# Altium schematic sheet SAMW25_Xplained_Pro_Connectors.SchDoc: Extension connectors
size A3; Organization: ATMEL Norway; Address1: Vestre Rosten 79; Address2: N-7075 TILLER; Address3: NORWAY; DocumentNumber: A09-2449; Revision: 1; SheetNumber: 4; SheetTotal: 5; PageSetup: Record=PageOptions|CenterHorizontal=True|CenterVertical=True|PrintScale=1.01|XCorrection=1.00|YCorrection=1.00|PrintKind=1|BorderSize=5000000|LeftOffset=0|BottomOffset=0|Orientation=2|PaperLength=1000|PaperWidth=1000|Scale=100|PaperSource=7|PrintQuality=-4|MediaType=1|DitherType=10|PaperKind=A3 (297 x 420 mm)|PrintScaleMode=1
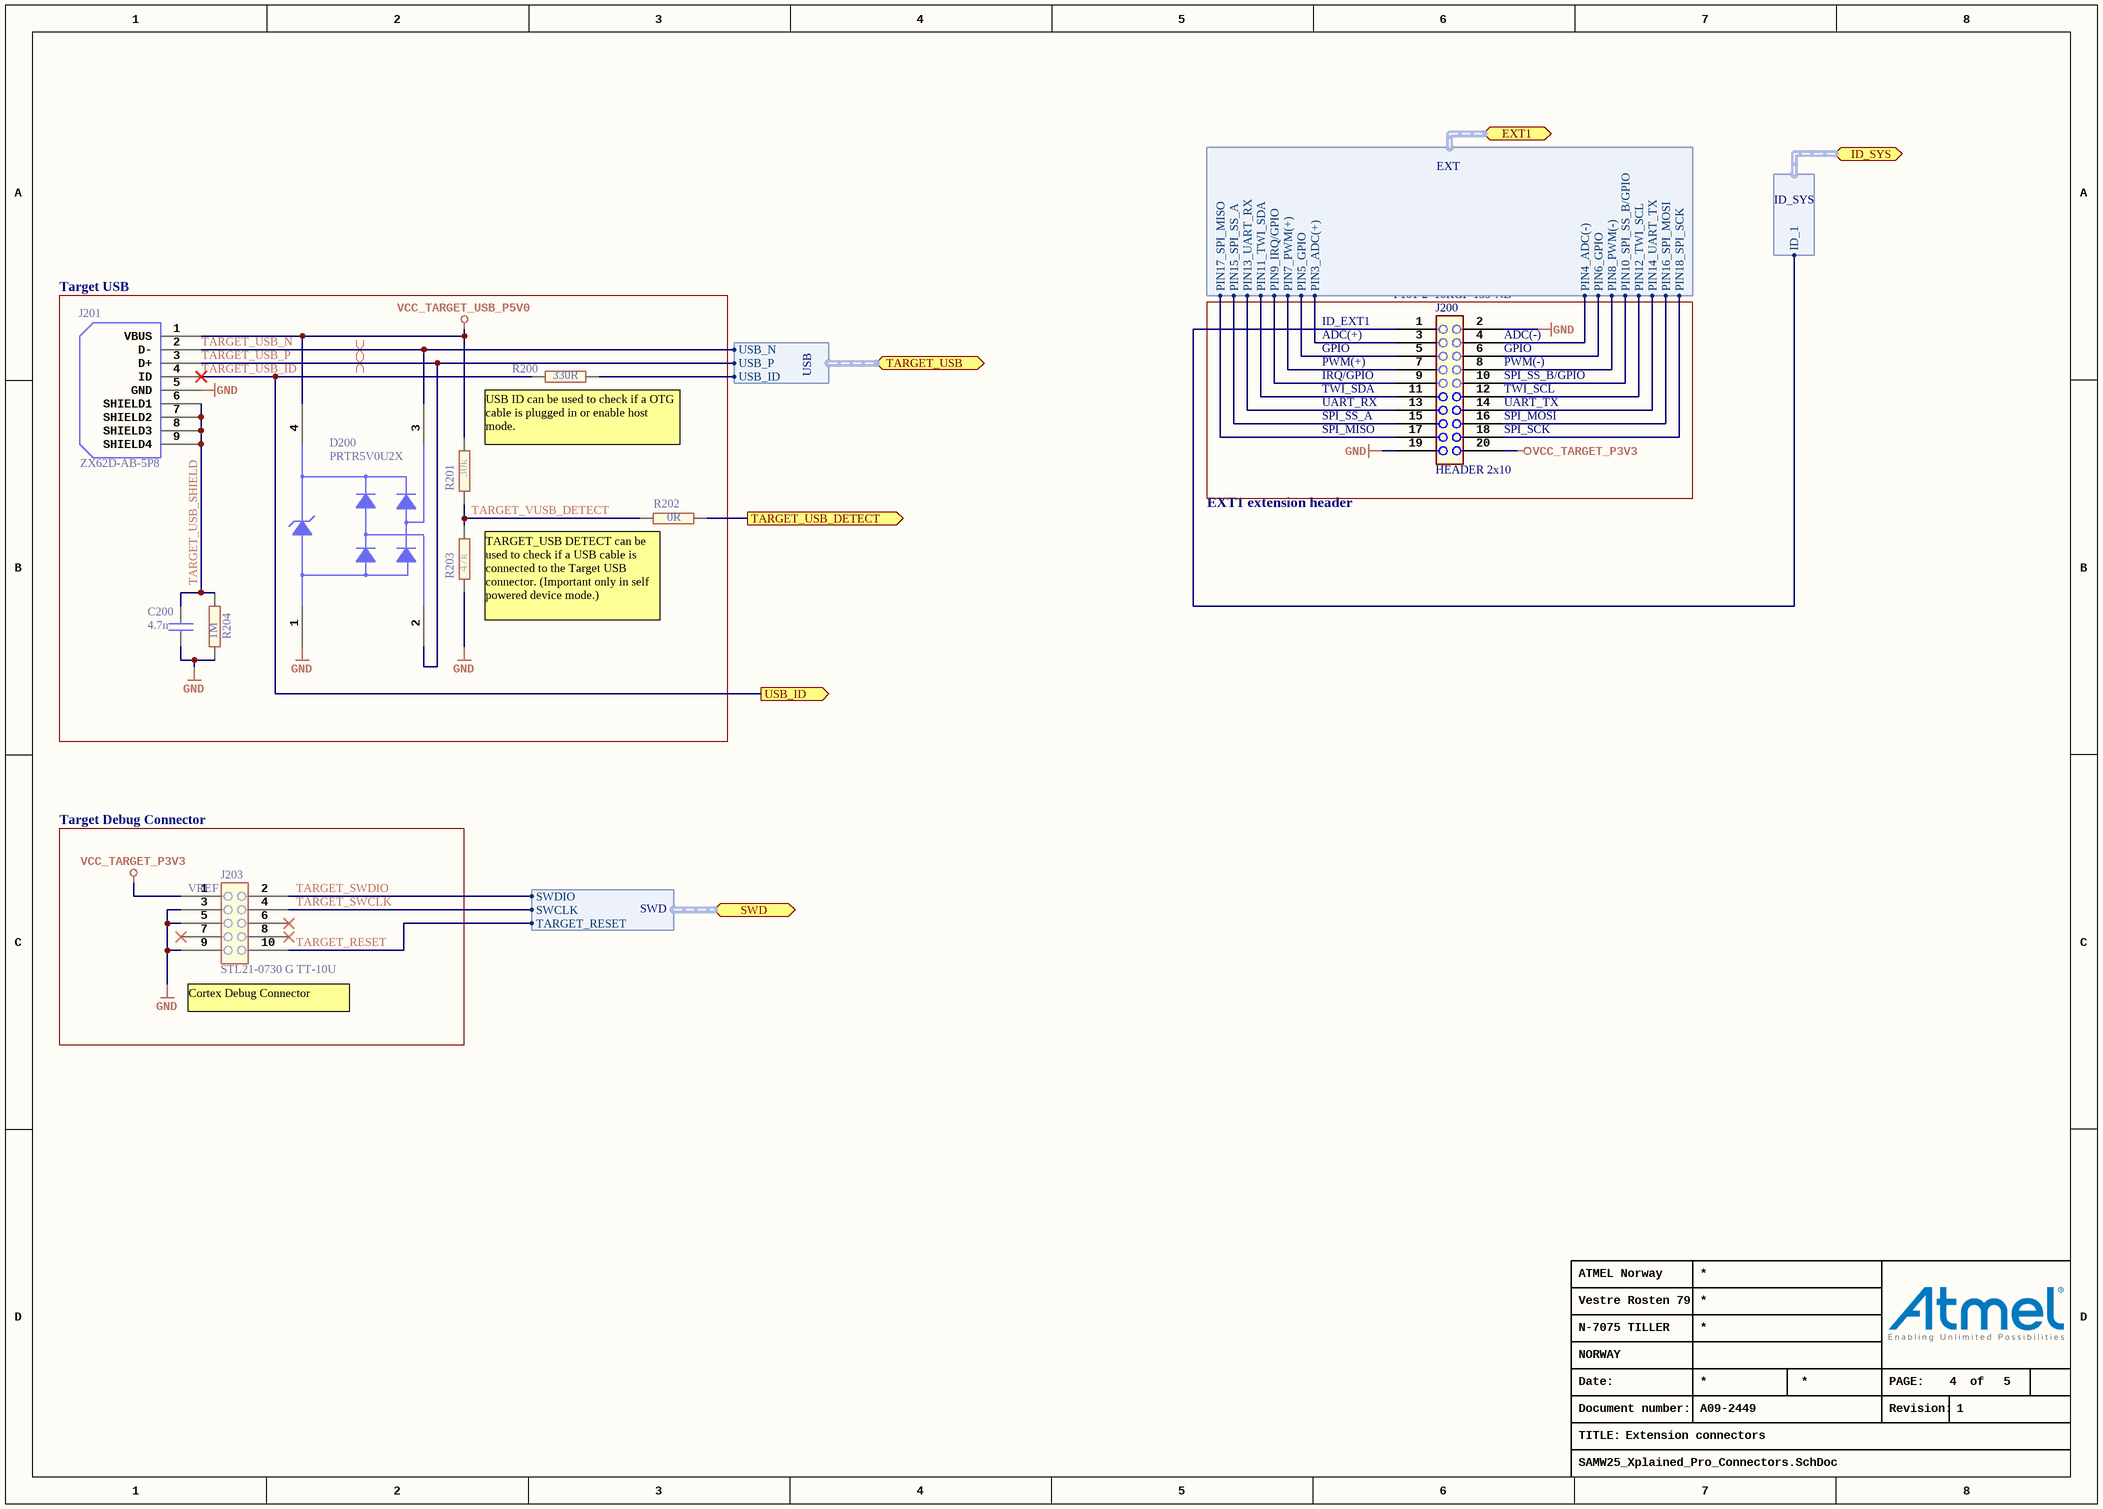
[diagram p0: SAMW25_Xplained_Pro_Connectors.SchDoc]

## Parts
C200  value 4.7n  [AP1-00053]  (hidden comment: CAP-NONPOL)
D200  PRTR5V0U2X  [AP4-00001]
J200  HEADER 2x10  value P101-2*10RGF-139-ND  [AP8-00622]
J201  value ZX62D-AB-5P8  [AP8-00852]  (hidden comment: 2,000 pieces per reel)
J203  MPN: STL21-0730 G TT-10U  [AP8-00257]  (hidden comment: HEADER 2x5)
R200  value 330R  [AP2-00000]  (hidden comment: R2)
R201  value 30k  [AP2-00011]  (hidden comment: R2)
R202  value 0R  [AP2-00000]  (hidden comment: R2)
R203  value 47k  [AP2-00011]  (hidden comment: R2)
R204  value 1M  [AP2-00011]  (hidden comment: R2)

## Blocks framed on the sheet
Target USB: C200 D200 J201 R200-R204
Target Debug Connector: J203

## Ports
EXT1 (harness EXT), ID_SYS (harness ID_SYS), SWD (harness SWD), TARGET_USB (harness USB), TARGET_USB_DETECT (out), USB_ID (out)

## Harnesses
ID_SYS: ID_1
EXT: PIN3_ADC(+), PIN4_ADC(-), PIN5_GPIO, PIN6_GPIO, PIN7_PWM(+), PIN8_PWM(-), PIN9_IRQ/GPIO, PIN10_SPI_SS_B/GPIO, PIN11_TWI_SDA, PIN12_TWI_SCL, PIN13_UART_RX, PIN14_UART_TX, PIN15_SPI_SS_A, PIN16_SPI_MOSI, PIN17_SPI_MISO, PIN18_SPI_SCK
USB: USB_P, USB_N, USB_ID
SWD: SWCLK, SWDIO, TARGET_RESET

## Nets
GND: C200.1 D200.1(GND) J200.2 J200.19 J201.5(GND) J203.3 J203.5 J203.9 R203.1 R204.1
VCC_TARGET_P3V3: J200.20 J203.1
VCC_TARGET_USB_P5V0: D200.4(VCC) J201.1(VBUS) R201.2
TARGET_RESET: J203.10 ; port SWD.TARGET_RESET
TARGET_SWCLK: J203.4 ; port SWD.SWCLK
TARGET_SWDIO: J203.2 ; port SWD.SWDIO
TARGET_USB_DETECT: R202.2 ; port TARGET_USB_DETECT
TARGET_USB_ID: J201.4(ID) R200.1 ; port USB_ID
TARGET_USB_N: D200.3(I/O_2) J201.2(D-) ; port TARGET_USB.USB_N
TARGET_USB_P: D200.2(I/O_1) J201.3(D+) ; port TARGET_USB.USB_P
TARGET_USB_SHIELD: C200.2 J201.6(SHIELD1) J201.7(SHIELD2) J201.8(SHIELD3) J201.9(SHIELD4) R204.2
TARGET_VUSB_DETECT: R201.1 R202.1 R203.2
NetJ200_1: J200.1 ; port ID_SYS.ID_1
NetJ200_3: J200.3 ; port EXT1.PIN3_ADC(+)
NetJ200_4: J200.4 ; port EXT1.PIN4_ADC(-)
NetJ200_5: J200.5 ; port EXT1.PIN5_GPIO
NetJ200_6: J200.6 ; port EXT1.PIN6_GPIO
NetJ200_7: J200.7 ; port EXT1.PIN7_PWM(+)
NetJ200_8: J200.8 ; port EXT1.PIN8_PWM(-)
NetJ200_9: J200.9 ; port EXT1.PIN9_IRQ/GPIO
NetJ200_10: J200.10 ; port EXT1.PIN10_SPI_SS_B/GPIO
NetJ200_11: J200.11 ; port EXT1.PIN11_TWI_SDA
NetJ200_12: J200.12 ; port EXT1.PIN12_TWI_SCL
NetJ200_13: J200.13 ; port EXT1.PIN13_UART_RX
NetJ200_14: J200.14 ; port EXT1.PIN14_UART_TX
NetJ200_15: J200.15 ; port EXT1.PIN15_SPI_SS_A
NetJ200_16: J200.16 ; port EXT1.PIN16_SPI_MOSI
NetJ200_17: J200.17 ; port EXT1.PIN17_SPI_MISO
NetJ200_18: J200.18 ; port EXT1.PIN18_SPI_SCK
NetR200_2: R200.2 ; port TARGET_USB.USB_ID

Not connected (* = marked no-connect by the designer): J203 6* 7* 8*

## Layout directives
differential pair: TARGET_USB_N, TARGET_USB_P

## Notes on the sheet
- ID_EXT1
- ADC(+)
- GPIO
- PWM(+)
- IRQ/GPIO
- (near J200) ADC(-)
- (near J200) GPIO
- (near J200) PWM(-)
- (near J200) SPI_SS_B/GPIO
- USB ID can be used to check if a OTG cable is plugged in or enable host mode.
- TWI_SDA
- UART_RX
- SPI_SS_A
- SPI_MISO
- (near J200) TWI_SCL
- (near J200) UART_TX
- (near J200) SPI_MOSI
- (near J200) SPI_SCK
- EXT1 extension header
- TARGET_USB DETECT can be used to check if a USB cable is connected to the Target USB connector. (Important only in self powered device mode.)
- (near J203) VREF
- (near J203) Cortex Debug Connector
- Date:
- PAGE:
- of
- TITLE:
- Document number:
- Revision:

## Library data of the parts
C200 = A01-0046: Ceramic capacitor, SMD 0402, X7R, 25V, +/-10%; PartGroup: Capacitors,Ceramic,SMD 0402; TemperatureRange: -55 - +125 deg C; ComponentStatus: 'Active (verified)'; Status: Active; Verified by: Lars Helge Mo; Verified date: 2005-12-15; AN: A01-0046; Tolerance: 25V, +/-10%; Height: 0.550000011920929; FootprintStatus: 'Active (Verified)'
D200 = A06-0236: Double rail-to-rail USB ESD protection diode; OrcadPartType: Integrated Circuits&Special function&Protection; Manufacturer: Philips; TemperatureRange: -40 to +85 C; ComponentStatus: 'Active (verified)'; Status: Active; Verified by: Lars Nordin; Verified date: 2007-08-13; AN: A06-0236; Value: PRTR5V0U2X; PartType: Buy; Height: 1,10000002384186; MPN: PRTR5V0U2X; FootprintStatus: 'Active (Verified)'
J200 = A08-1513: Pin header, 2x10, Right Angle, 2.54mm, THM, Pin In Paste; PartGroup: Mechanical devices,Connectors,Pin headers; ComponentStatus: 'New (not verified)'; Status: Active; Verified by: Lars Helge Mo; Verified date: 2005-12-19; AN: A08-1513; MPN: P101-2*10RGF-139-ND; FootprintStatus: 'Active (Verified)'
J201 = A08-2112: Micro USB AB Connector, Standard SMT + DIP; PartGroup: Mechanical devices,Connectors,USB; ComponentStatus: 'Active (verified)'; Verified date: 2006-05-18; Verified by: Eirik Rasmussen; Status: Active; AN: A08-2112; Height: 2.79999995231628; FootprintStatus: 'New (Not verified)'
J203 = A08-0385: 2x5 pin header, 1.27mm pitch, THM; PartGroup: Mechanical devices,Connectors,Pin headers; Manufacturer: Garry; Value: PIN HEADER 2x5; ComponentStatus: 'Active (verified)'; Verified date: 2005-12-19; Verified by: Lars Helge Mo; Status: Active; AN: A08-0385; Height: 7.30000019073486; FootprintStatus: 'Active (Verified)'
R200 = A02-0200: Thick film resistor, SMD 0402, 1/16W, 1%; PartGroup: Resistors,SMD,0402 1%; TemperatureRange: -55 - +125 deg C; ComponentStatus: 'Active (verified)'; Status: Active; Verified by: Lars Helge Mo; Verified date: 2005-12-19; AN: A02-0200; Tolerance: 1 %; Height: 0.349999994039536; FootprintStatus: 'Active (Verified)'
R201 = A02-0247: Thick film resistor, SMD 0402, 1/16W, 1%; PartGroup: Resistors,SMD,0402 1%; TemperatureRange: -55 - +125 deg C; ComponentStatus: 'Active (verified)'; Status: Active; Verified by: Lars Helge Mo; Verified date: 2005-12-19; AN: A02-0247; Tolerance: 1 %; Height: 0.349999994039536; FootprintStatus: 'Active (Verified)'
R202 = A02-0163: RES 0.0 OHM 1/16W 0402 SMD; PartGroup: Resistors,SMD,0402 1%; MPN: RMCF0402ZT0R00; Tolerance: 1 %; TemperatureRange: -55 - +125 deg C; ComponentStatus: 'Active (verified)'; Status: Active; Verified by: Lars Helge Mo; Verified date: 2005-12-19; AN: A02-0163; Height: 0,349999994039536; FootprintStatus: 'Active (Verified)'
R203 = A02-0252: Thick film resistor, SMD 0402, 1/16W, 1%; PartGroup: Resistors,SMD,0402 1%; TemperatureRange: -55 - +125 deg C; ComponentStatus: 'Active (verified)'; Status: Active; Verified by: Lars Helge Mo; Verified date: 2005-12-19; AN: A02-0252; Tolerance: 1 %; Height: 0.349999994039536; FootprintStatus: 'Active (Verified)'
R204 = A02-0284: Thick film resistor, SMD 0402, 1/16W, 1%; PartGroup: Resistors,SMD,0402 1%; Manufacturer: KOA; MPN: RK73H1ETTP1004F; TemperatureRange: -55 - +125 deg C; ComponentStatus: 'Active (verified)'; Status: Active; Verified by: Lars Helge Mo; Verified date: 2005-12-19; AN: A02-0284; Tolerance: 1 %; Height: 0,349999994039536; FootprintStatus: 'Active (Verified)'